# Altium schematic sheet StereoscopicPi.SchDoc
size A2; Organization: Altium Limited; Address1: L3, 12a Rodborough Rd; Address2: Frenchs Forest; Address3: NSW; Address4: Australia 2086
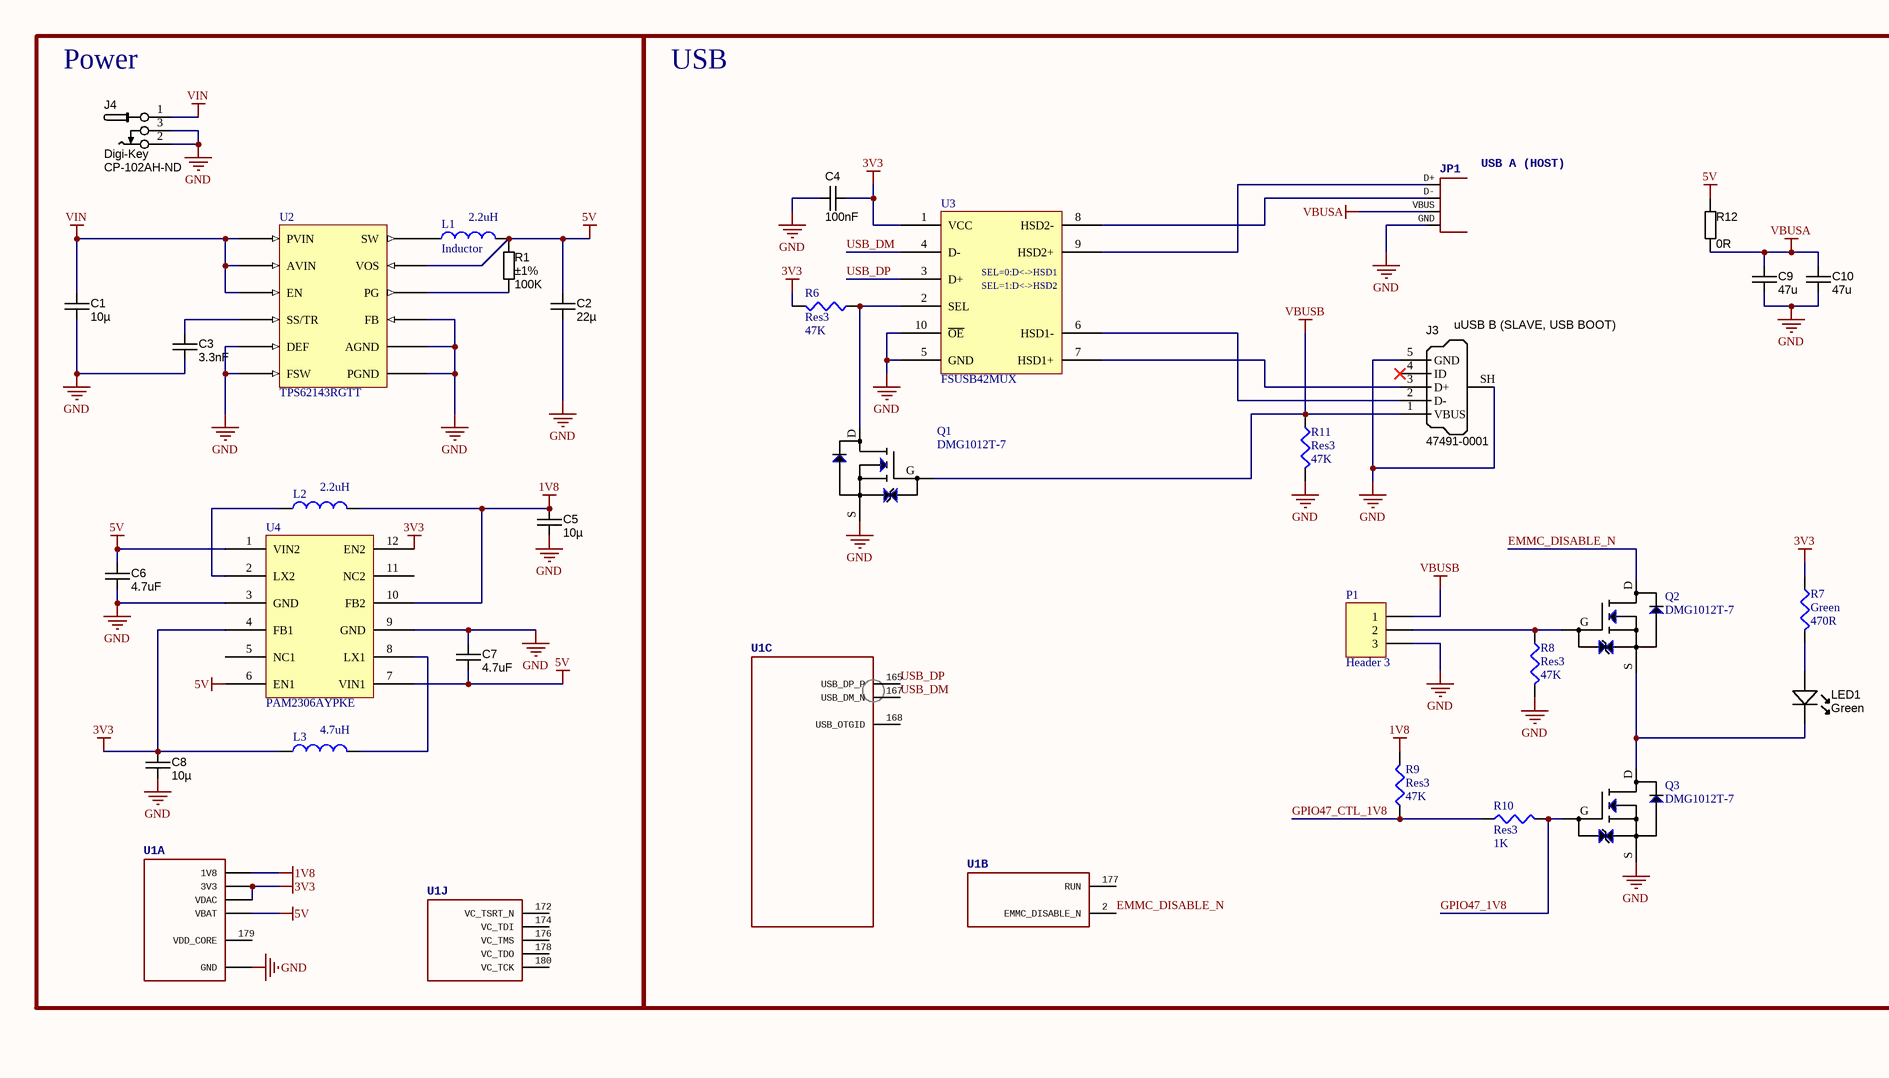
[diagram p0: StereoscopicPi.SchDoc, top left]
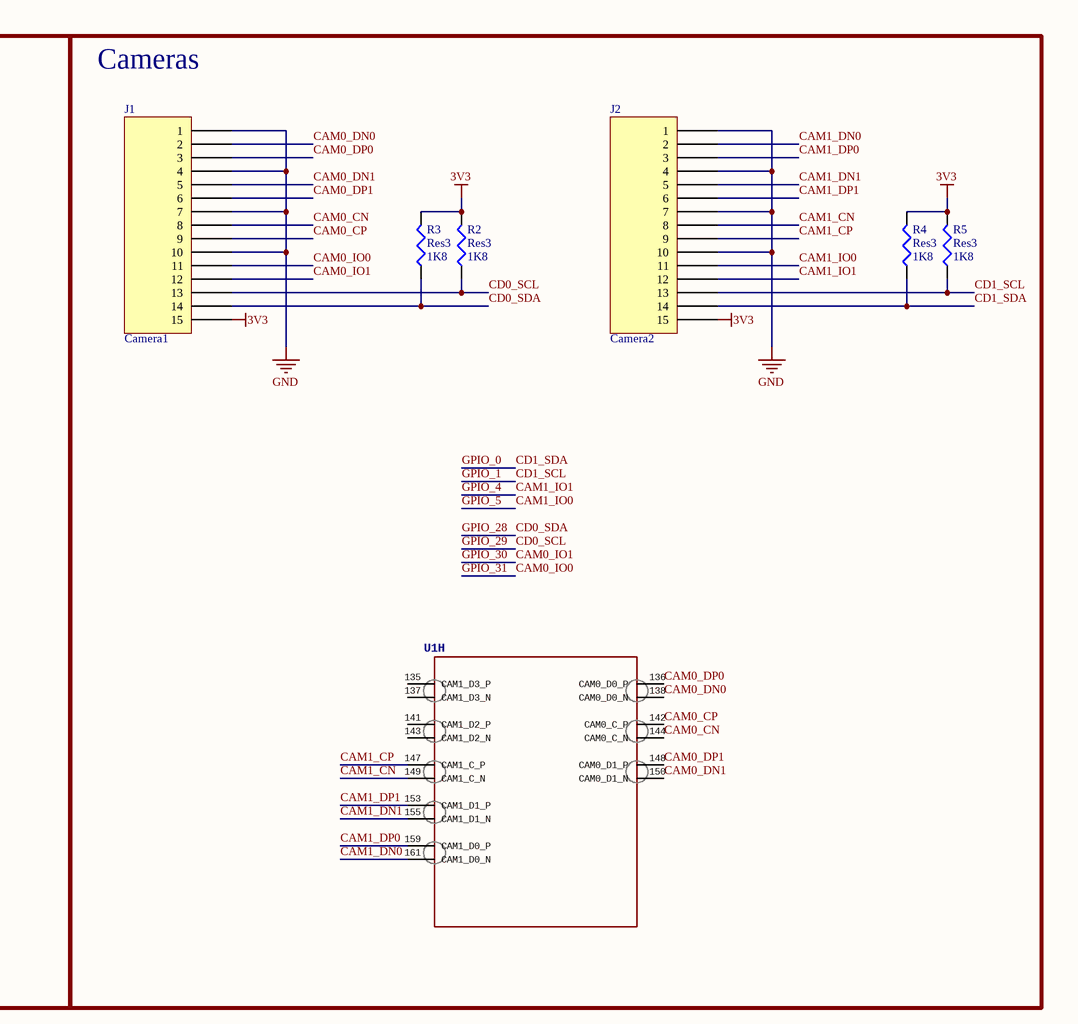
[diagram p1: StereoscopicPi.SchDoc, top right]
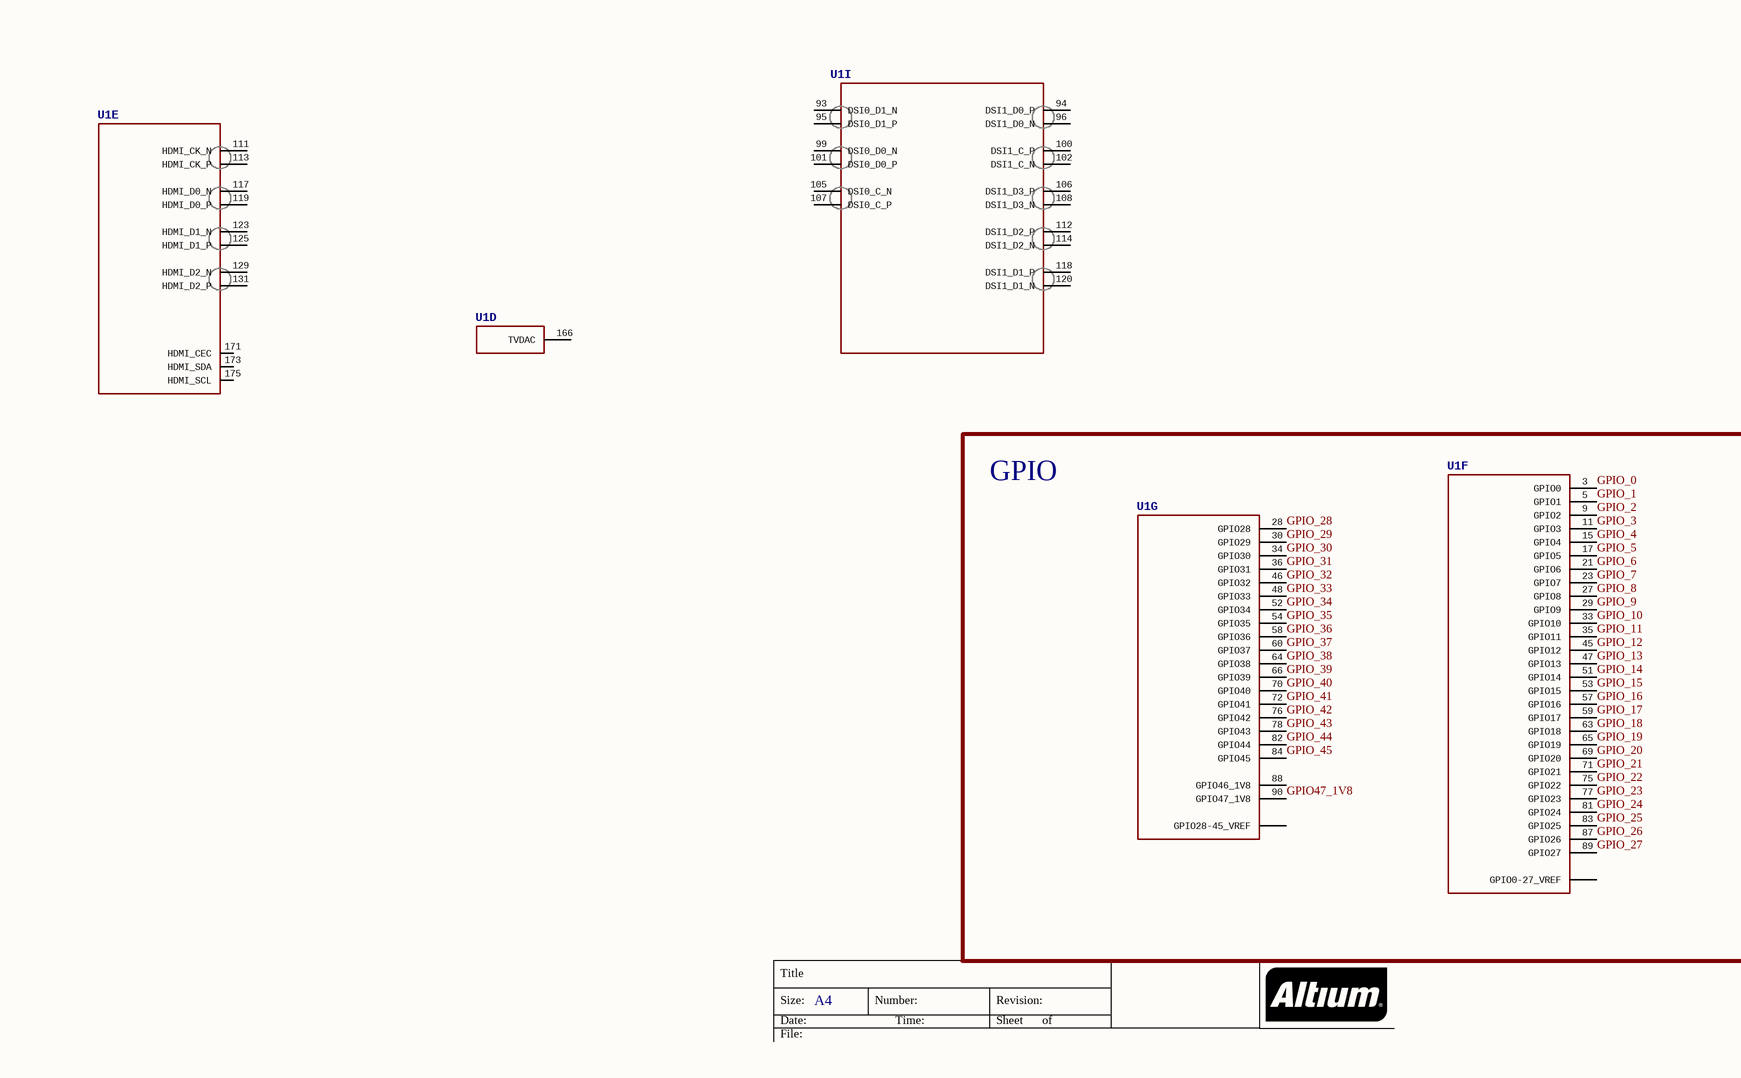
[diagram p2: StereoscopicPi.SchDoc, bottom left]

## Parts
C1  10µ  [CAPC3225X220N]
C2  value 22µ  [CAPC3225X220N]  (hidden comment: approved sub OK)
C3  value 3.3nF  [CAPC1608X90N]  (hidden comment: Kemet C0603C332J3RACTU)
C4  value 100nF  [CAPC1608X90N]
C5  10µ  [CAPC3225X220N]
C6  value 4.7uF  [CAPC2012X135N]  (hidden comment: approved sub OK)
C7  value 4.7uF  [CAPC2012X135N]  (hidden comment: approved sub OK)
C8  10µ  [CAPC3225X220N]
C9  47u  [CAPC3225X220N]
C10  47u  [CAPC3225X220N]
J1  Camera1  [SFW15R-2STE1LF]
J2  Camera2  [SFW15R-2STE1LF]
J3  uUSB B (SLAVE, USB BOOT)  Manufacturer Part Number 1: 47491-0001  [USB_Micro-B_Molex_SMD]
J4  Supplier 1: Digi-Key  Supplier Part Number 1: CP-102AH-ND  [CONN_PWR_JACK_2.1x5.5mm]  (hidden comment: CONN_PWR_JACK_2.1x5.5mm)
JP1  USB A (HOST)  [USB-A-S-NOSILK-FEMALE]
L1  Inductor  value 2.2uH  [IHLP-1212BZ-11]
L2  value 2.2uH  [IHLP-1212BZ-11]  (hidden comment: IHLP1212BZER2R2M11)
L3  value 4.7uH  [IHLP-2020CZ-11]  (hidden comment: IHLP2020CZER4R7M11)
LED1  Green  [LED-0603-GREEN]
P1  Header 3  [HDR1X3]
Q1  DMG1012T-7  [DMG1012T-7]
Q2  DMG1012T-7  [DMG1012T-7]
Q3  DMG1012T-7  [DMG1012T-7]
R1  value 100K  Tolerance: ±1%  [RESC1608X55N]  (hidden comment: Thick Film)
R2  Res3  value 1K8  [J1-0603]
R3  Res3  value 1K8  [J1-0603]
R4  Res3  value 1K8  [J1-0603]
R5  Res3  value 1K8  [J1-0603]
R6  Res3  value 47K  [J1-0603]
R7  Green  value 470R  [J1-0603]
R8  Res3  value 47K  [J1-0603]
R9  Res3  value 47K  [J1-0603]
R10  Res3  value 1K  [J1-0603]
R11  Res3  value 47K  [J1-0603]
R12  value 0R  [RESC1608X55N]  (hidden comment: Thick Film)
U1  Raspberry Pi Compute Module As anounced in this blog post  http://www.raspberrypi.org/raspberry-pi-compute-module-new-product/  Based on infomation from this schematic http://www.raspberrypi.org/wp-content/uploads/2014/04/RPI-CM-V1_1-SCHEMATIC.pdf  Footprint is unproven and no matching part confimed as of yet  [1-1376408-4]  (value not drawn)  (parts A,B,C,D,E,F,G,H,I,J of 10)
U2  TPS62143RGTT  [QFN50P300X300X100_HS-17M]
U3  FSUSB42MUX  [FSUSB42MUX]
U4  PAM2306AYPKE  [PAM2306]

## Blocks framed on the sheet
Power: C1-C3 C5-C8 J4 L1-L3 R1 U1 U2 U4
USB: C4 C9 C10 J3 JP1 LED1 P1 Q1-Q3 R6-R12 U1 U3
Cameras: J1 J2 R2-R5 U1
GPIO: U1

## Nets
1V8: C5.1 L2.1 R9.2 U1.1V8 U4.10(FB2)
3V3: C4.2 C8.1 J1.15 J2.15 L3.0 R2.2 R3.2 R4.2 R5.2 R6.2 R7.1 U1.3V3 U1.VDAC U3.1(VCC) U4.4(FB1) U4.12(EN2)
5V: C2.1 C6.1 C7.2 L1.1 R1.1 R12.1 U1.VBAT U2.14(VOS) U4.1(VIN2) U4.6(EN1) U4.7(VIN1)
GND: C1.2 C2.2 C3.2 C4.1 C5.2 C6.2 C7.1 C8.2 C9.2 C10.2 J1.1 J1.4 J1.7 J1.10 J2.1 J2.4 J2.7 J2.10 J3.5(GND) J3.SH(Shell) J4.2 J4.3 JP1.GND P1.3 Q1.S Q3.S R8.2 R11.2 U1.GND U2.5(FB) U2.6(AGND) U2.7(FSW) U2.8(DEF) U2.15(PGND) U3.5(GND) U3.10(~{OE}) U4.3(GND) U4.9(GND)
VBUSA: C9.1 C10.1 JP1.VBUS R12.2
VBUSB: J3.1(VBUS) P1.1 Q1.G R11.1
VIN: C1.1 J4.1 U2.10(AVIN) U2.11(PVIN) U2.13(EN)
CAM0_CN: J1.8 U1.144(CAM0_C_N)
CAM0_CP: J1.9 U1.142(CAM0_C_P)
CAM0_DN0: J1.2 U1.138(CAM0_D0_N)
CAM0_DN1: J1.5 U1.150(CAM0_D1_N)
CAM0_DP0: J1.3 U1.136(CAM0_D0_P)
CAM0_DP1: J1.6 U1.148(CAM0_D1_P)
CAM0_IO0: J1.11 U1.36(GPIO31)  [also labelled GPIO_31]
CAM0_IO1: J1.12 U1.34(GPIO30)  [also labelled GPIO_30]
CAM1_CN: J2.8 U1.149(CAM1_C_N)
CAM1_CP: J2.9 U1.147(CAM1_C_P)
CAM1_DN0: J2.2 U1.161(CAM1_D0_N)
CAM1_DN1: J2.5 U1.155(CAM1_D1_N)
CAM1_DP0: J2.3 U1.159(CAM1_D0_P)
CAM1_DP1: J2.6 U1.153(CAM1_D1_P)
CAM1_IO0: J2.11 U1.17(GPIO5)  [also labelled GPIO_5]
CAM1_IO1: J2.12 U1.15(GPIO4)  [also labelled GPIO_4]
CD0_SCL: J1.13 R2.1 U1.30(GPIO29)  [also labelled GPIO_29]
CD0_SDA: J1.14 R3.1 U1.28(GPIO28)  [also labelled GPIO_28]
CD1_SCL: J2.13 R5.1 U1.5(GPIO1)  [also labelled GPIO_1]
CD1_SDA: J2.14 R4.1 U1.3(GPIO0)  [also labelled GPIO_0]
EMMC_DISABLE_N: Q2.D U1.2(EMMC_DISABLE_N)
GPIO47_1V8: Q3.G R10.2 U1.90(GPIO47_1V8)
GPIO47_CTL_1V8: R9.1 R10.1
GPIO_2: U1.9(GPIO2)
GPIO_3: U1.11(GPIO3)
GPIO_6: U1.21(GPIO6)
GPIO_7: U1.23(GPIO7)
GPIO_8: U1.27(GPIO8)
GPIO_9: U1.29(GPIO9)
GPIO_10: U1.33(GPIO10)
GPIO_11: U1.35(GPIO11)
GPIO_12: U1.45(GPIO12)
GPIO_13: U1.47(GPIO13)
GPIO_14: U1.51(GPIO14)
GPIO_15: U1.53(GPIO15)
GPIO_16: U1.57(GPIO16)
GPIO_17: U1.59(GPIO17)
GPIO_18: U1.63(GPIO18)
GPIO_19: U1.65(GPIO19)
GPIO_20: U1.69(GPIO20)
GPIO_21: U1.71(GPIO21)
GPIO_22: U1.75(GPIO22)
GPIO_23: U1.77(GPIO23)
GPIO_24: U1.81(GPIO24)
GPIO_25: U1.83(GPIO25)
GPIO_26: U1.87(GPIO26)
GPIO_27: U1.89(GPIO27)
GPIO_32: U1.46(GPIO32)
GPIO_33: U1.48(GPIO33)
GPIO_34: U1.52(GPIO34)
GPIO_35: U1.54(GPIO35)
GPIO_36: U1.58(GPIO36)
GPIO_37: U1.60(GPIO37)
GPIO_38: U1.64(GPIO38)
GPIO_39: U1.66(GPIO39)
GPIO_40: U1.70(GPIO40)
GPIO_41: U1.72(GPIO41)
GPIO_42: U1.76(GPIO42)
GPIO_43: U1.78(GPIO43)
GPIO_44: U1.82(GPIO44)
GPIO_45: U1.84(GPIO45)
USB_DM: U1.167(USB_DM_N) U3.4(D-)
USB_DP: U1.165(USB_DP_P) U3.3(D+)
NetC3_1: C3.1 U2.9(SS/TR)
NetJ3_2: J3.2(D-) U3.6(HSD1-)
NetJ3_3: J3.3(D+) U3.7(HSD1+)
NetJP1_D+: JP1.D+ U3.9(HSD2+)
NetJP1_D-: JP1.D- U3.8(HSD2-)
NetL1_0: L1.0 U2.1(SW)
NetL2_0: L2.0 U4.2(LX2)
NetL3_1: L3.1 U4.8(LX1)
NetLED1_A: LED1.A R7.2
NetLED1_K: LED1.K Q2.S Q3.D
NetP1_2: P1.2 Q2.G R8.1
NetQ1_D: Q1.D R6.1 U3.2(SEL)
NetR1_2: R1.2 U2.4(PG)

Not connected (* = marked no-connect by the designer): J3 4(ID)*; U1 39 40(GPIO0-27_VREF) 41 42(GPIO28-45_VREF) 88(GPIO46_1V8) 93(DSI0_D1_N) 94(DSI1_D0_P) 95(DSI0_D1_P) 96(DSI1_D0_N) 99(DSI0_D0_N) 100(DSI1_C_P) 101(DSI0_D0_P) 102(DSI1_C_N) 105(DSI0_C_N) 106(DSI1_D3_P) 107(DSI0_C_P) 108(DSI1_D3_N) 111(HDMI_CK_N) 112(DSI1_D2_P) 113(HDMI_CK_P) 114(DSI1_D2_N) 117(HDMI_D0_N) 118(DSI1_D1_P) 119(HDMI_D0_P) 120(DSI1_D1_N) 123(HDMI_D1_N) 125(HDMI_D1_P) 129(HDMI_D2_N) 131(HDMI_D2_P) 135(CAM1_D3_P) 137(CAM1_D3_N) 141(CAM1_D2_P) 143(CAM1_D2_N) 166(TVDAC) 168(USB_OTGID) 171(HDMI_CEC) 172(VC_TSRT_N) 173(HDMI_SDA) 174(VC_TDI) 175(HDMI_SCL) 176(VC_TMS) 177(RUN) 178(VC_TDO) 179(VDD_CORE) 180(VC_TCK); U4 5(NC1) 11(NC2)

## Notes on the sheet
- Title
- Size:
- Date:
- A4
- Number:
- Time:
- Revision:
- Sheet
- of
- File:
- (in symbol FSUSB42MUX) SEL=0:D<->HSD1; SEL=1:D<->HSD2

## Library data of the parts
C1 C5 C8 = CAPC_10u_1210_50V: Capacitor SMD Cer 10uF 20% 16V X5R 1210; Manufacturer 1: Taiyo Yuden; Manufacturer Part Number 1: UMK325BJ106MM-T; Ratings: 50V; X5R; Material: ceramic; SCDType: spec; Package / Case: 1210 (3225 Metric); Tolerance: ±20%; Size / Dimension: 0.126" L x 0.098" W (3.20mm x 2.50mm); Supplier 1: Digi-Key; Supplier Part Number 1: 587-2225-1-ND; Value: 10µ
C2 = CAPC_22u_1210_6V3_X5R: Capacitor SMD Cer 22uF 20% 6.3V X5R 1210; Manufacturer 1: TDK Corporation; Manufacturer Part Number 1: C3225X5R0J226M/2.00; Ratings: 6.3V; X5R; Voltage - Rated: 6V3; SCDType: spec; Tolerance: ±20%; Package / Case: 1210 (3225 metric); Supplier 1: Digi-Key; Supplier Part Number 1: 445-1595-1-ND; Mounting Type: Surface Mount, MLCC; Operating Temperature: -55°C ~ 85°C; Thickness (Max): 0.087" (2.20mm); ComponentLink1URL: http://www.tdk.com/pdf/general_B11.pdf; ComponentLink1Description: http://www.tdk.com/pdf/general_B11.pdf
C3 C4 = CAPC_10n_0603_X7R_50V_10%: Capacitor SMD Cer 10nF 10% 50V X7R 0603; Manufacturer 1: TDK Corporation; Manufacturer Part Number 1: C1608X7R1H103K; Ratings: 50V; X7R; Material: ceramic; SCDType: spec; Package / Case: 0603 (1608 metric); Tolerance: ±10%; Supplier 1: Digi-Key; Supplier Part Number 1: 445-1311-1-ND; ComponentLink1URL: http://product.tdk.com/capacitor/mlcc/en/documents/mlcc_commercial_general_en.pdf; ComponentLink1Description: http://product.tdk.com/capacitor/mlcc/en/documents/mlcc_commercial_general_en.pdf; Supplier 2: Digi-Key; Supplier Part Number 2: 478-1227-1-ND; Manufacturer 2: AVX Corporation; Manufacturer Part Number 2: 06035C103KAT2A; ComponentLink2URL: http://www.avx.com/docs/Catalogs/cx7r.pdf; ComponentLink2Description: http://www.avx.com/docs/Catalogs/cx7r.pdf
C6 C7 = CAPC_4u7_0805: Capacitor SMD Cer 4.7uF 10% 16V X5R 0805; Manufacturer 1: Taiyo Yuden; Manufacturer Part Number 1: EMK212BJ475KG-T; Ratings: 16V; X5R; Material: ceramic; SCDType: spec; Package / Case: 0805 (2012 Metric); Tolerance: ±10%; Supplier 1: Digi-Key; Supplier Part Number 1: 587-1294-1-ND; Operating Temperature: -55°C ~ 85°C; Size / Dimension: 0.079" L x 0.049" W (2.00mm x 1.25mm); Thickness (Max): 0.053" (1.35mm); ComponentLink1URL: http://www.yuden.co.jp/productdata/catalog/en/mlcc01_e.pdf; ComponentLink1Description: http://www.yuden.co.jp/productdata/catalog/en/mlcc01_e.pdf; Supplier 2: Digi-Key; Supplier Part Number 2: 1276-1065-1-ND; Manufacturer 2: Samsung Electro-Mechanics America, Inc; Manufacturer Part Number 2: CL21A475KOFNNNE; RoHS 2: RoHS Compliant; ComponentLink2URL: http://www.samsungsem.com/servlet/FileDownload?type=spec&file=CL21A475KOFNNNE.pdf; ComponentLink2Description: http://www.samsungsem.com/servlet/FileDownload?type=spec&file=CL21A475KOFNNNE.pdf; Supplier 3: Digi-Key; Supplier Part Number 3: 399-8101-1-ND; Manufacturer 3: Kemet; Manufacturer Part Number 3: C0805C475K4PACTU; RoHS 3: RoHS Compliant; ComponentLink3URL: http://capacitoredge.kemet.com/capedge2/DataSheet?pn=C0805C475K4PACTU; ComponentLink3Description: http://capacitoredge.kemet.com/capedge2/DataSheet?pn=C0805C475K4PACTU; Supplier 4: Digi-Key; Supplier Part Number 4: 490-7215-1-ND; Manufacturer 4: Murata Electronics North America; Manufacturer Part Number 4: GRM21BR61C475MA88L; RoHS 4: RoHS Compliant; ComponentLink4URL: http://psearch.murata.com/capacitor/product/GRM21BR61C475MA88#.pdf; ComponentLink4Description: http://psearch.murata.com/capacitor/product/GRM21BR61C475MA88#.pdf; Supplier 5: Digi-Key; Supplier Part Number 5: 445-7640-1-ND; Manufacturer 5: TDK Corporation; Manufacturer Part Number 5: C2012X5R1C475K125AC; RoHS 5: RoHS Compliant; ComponentLink5URL: http://product.tdk.com/capacitor/mlcc/en/documents/mlcc_commercial_general_en.pdf; ComponentLink5Description: http://product.tdk.com/capacitor/mlcc/en/documents/mlcc_commercial_general_en.pdf; RoHS 1: RoHS Compliant
C9 C10 = CAPC_47u_1210_10V_X5R_10%: Capacitor SMD Cer 47uF 10% 10V 1210; Manufacturer 1: Murata Electronics North America; Manufacturer Part Number 1: GRM32ER61A476KE20L; Ratings: 10V; X5R; SCDType: undef; Package / Case: 1210 (3225 Metric); Tolerance: ±10%; Operating Temperature: -55°C ~ 85°C; Size / Dimension: 0.126" L x 0.098" W (3.20mm x 2.50mm); Supplier 1: Digi-Key; Voltage - Rated: 10V; Supplier Part Number 1: 490-3887-2-ND; Value: 47u
J1 J2 = SFW15R-2STE1LF
J3 = USB_Micro_TypeB: Connector SMD USB Micro Type B middle mount; Manufacturer 1: Molex Inc; SCDType: undef; Package / Case: SMD; Supplier 1: Digi-Key; Supplier Part Number 1: WM17142CT-ND
J4 = CONN_PWR_JACK_2.1x5.5mm: Power Connector, THT, 2.1mm ID, 5.5mm OD; Manufacturer 1: CUI Inc; Manufacturer Part Number 1: PJ-102AH; SCDType: undef; Category: Connectors; Mounting Type: Through Hole; Package / Case: PCB mount; Value: 2.1mm ID, 5.5mm OD
JP1 = USB-A-SMD: PROD_ID: CONN-09520
L1-L3 = Inductor: Code_IEC: 1005; Published: 8-Jun-2000; LatestRevisionDate: 29-May-2009; LatestRevisionNote: IPC-7351 Footprint Added.; PackageReference: 0402-A; Publisher: Altium Limited; PackageDescription: Chip Inductor; Code_JEITA: 0402
  L2: Digikey: 541-1322-1-ND
  L3: Digikey: 541-1238-1-ND
LED1 = LED_SMD_Green_0603_570nm: LED 0603 SMD Green 570nm 50mcd 20mA; Manufacturer 1: Kingbright Company LLC; Manufacturer Part Number 1: APT1608CGCK; Material: AlGaInP; Ratings: 20mcd min; 50 mcd typ; 570 nm; Voltage - Forward (Vf) Typ: 2.1V; Viewing Angle: 120°; Lens Style/Size: Rectangle with Flat Top, 1.1mm x 0.8mm; Voltage - Forward (Vf) @ 10mA: 2.0V; SCDType: source; Wavelength - Peak: 574nm; Lens Type: Clear; Package / Case: 0603 (1608 metric); Color: Green; Current - Test: 20mA; Supplier 1: Digi-Key; Supplier Part Number 1: 754-1116-1-ND; RoHS 1: RoHS Compliant; Wavelength - Dominant: 570nm; ComponentLink1URL: http://www.us.kingbright.com/images/catalog/SPEC/APT1608CGCK.pdf; ComponentLink1Description: http://www.us.kingbright.com/images/catalog/SPEC/APT1608CGCK.pdf
P1 = Header 3: Header, 3-Pin; LatestRevisionDate: 17-Jul-2002; LatestRevisionNote: Re-released for DXP Platform.; Publisher: Altium Limited
R1 R12 = RES_100K_0603_1%: Resistor SMD chip 100k Ohm 0.1W 1% 0603; Manufacturer 1: Vishay/Dale; Manufacturer Part Number 1: CRCW0603100KFKEA; Ratings: 1/10W; SCDType: spec; Package / Case: 0603 (2012 metric); Supplier 1: Digi-Key; Supplier Part Number 1: 541-100KHCT-ND
  R12: Tolerance: ±1%
R2-R11 = Res3: Resistor; Published: 8-Jun-2000; LatestRevisionDate: 29-May-2009; LatestRevisionNote: IPC-7351 Footprint Added.; PackageReference: J1-0603; Publisher: Altium Limited; PackageDescription: Chip Resistor
U1 = RASPBERRY_PI_CM-1-1376408-4
U2 = TPS62143 5V 2A LDO SMPS Buck
U4 = PAM2306